# EAGLE design V2 (EAGLE 9.3.0)
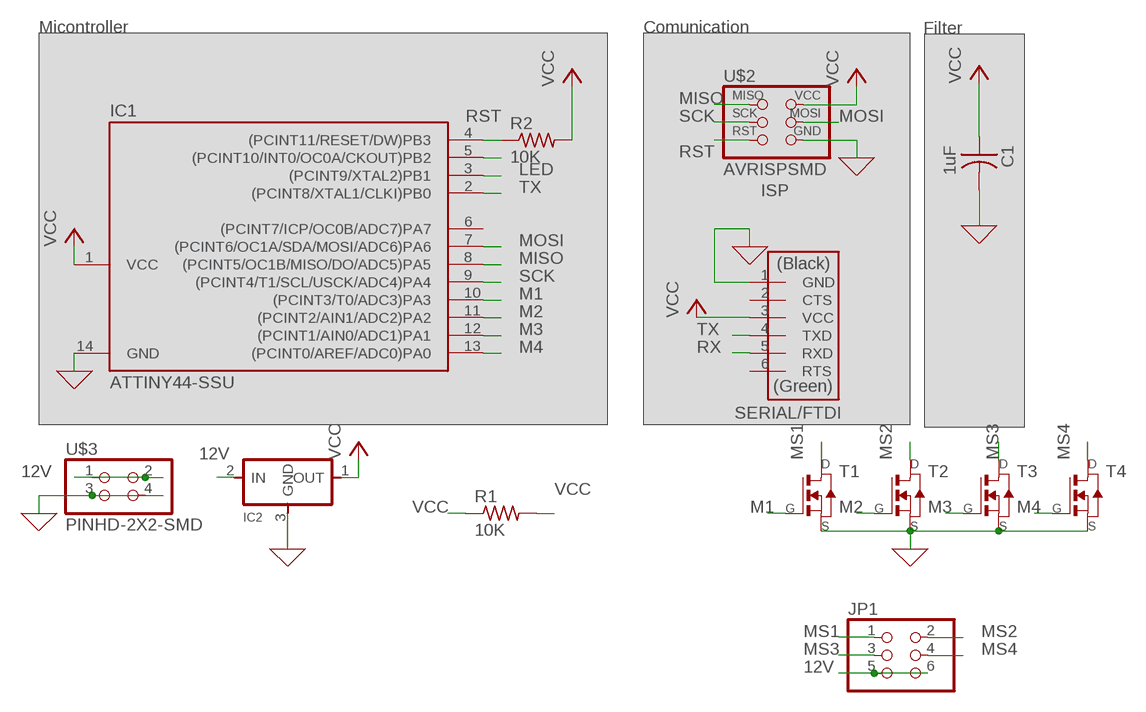
[diagram p0: schematic, sheet 1]

## Parts
C1  1uF  CAP-US1206FAB  [C1206FAB]
IC1  ATTINY44-SSU  [SOIC14]
IC2  REGULATORSOT23  [SOT23]
JP1  PINHD-2X3-SMD  [2X03SMD]
R1  10K  RES-US1206FAB  [R1206FAB]
R2  10K  RES-US1206FAB  [R1206FAB]
T1  NMOSFETSOT23  [SOT-23]
T2  NMOSFETSOT23  [SOT-23]
T3  NMOSFETSOT23  [SOT-23]
T4  NMOSFETSOT23  [SOT-23]
U$1  FTDI-SMD-HEADER  [1X06SMD]
U$2  AVRISPSMD  [2X03SMD]
U$3  PINHD-2X2-SMD  [2X02SMD]

## Nets
0: C1.2 IC1.14(GND) IC2.3(GND) T1.2(S) T2.2(S) T3.2(S) T4.2(S) U$1.1(GND) U$2.6(GND) U$3.3 U$3.4 ; supply symbol labelled GND
12V: IC2.2(IN) JP1.5 JP1.6 U$3.1 U$3.2
LED: IC1.3((PCINT9/XTAL2)PB1)
M1: IC1.10((PCINT3/T0/ADC3)PA3) T1.3(G)
M2: IC1.11((PCINT2/AIN1/ADC2)PA2) T2.3(G)
M3: IC1.12((PCINT1/AIN0/ADC1)PA1) T3.3(G)
M4: IC1.13((PCINT0/AREF/ADC0)PA0) T4.3(G)
MISO: IC1.8((PCINT5/OC1B/MISO/DO/ADC5)PA5) U$2.1(MISO)
MOSI: IC1.7((PCINT6/OC1A/SDA/MOSI/ADC6)PA6) U$2.4(MOSI)
MS1: JP1.1 T1.1(D)
MS2: JP1.2 T2.1(D)
MS3: JP1.3 T3.1(D)
MS4: JP1.4 T4.1(D)
N$5: IC1.5((PCINT10/INT0/OC0A/CKOUT)PB2)
RST: IC1.4((PCINT11/RESET/DW)PB3) R2.1 U$2.5(RST)
RX: U$1.5(RXD)
SCK: IC1.9((PCINT4/T1/SCL/USCK/ADC4)PA4) U$2.3(SCK)
TX: IC1.2((PCINT8/XTAL1/CLKI)PB0) U$1.4(TXD)
VCC: C1.1 IC1.1(VCC) IC2.1(OUT) R1.1 R1.2 R2.2 U$1.3(VCC) U$2.2(VCC)
Unconnected: IC1.6((PCINT7/ICP/OC0B/ADC7)PA7) U$1.2(CTS) U$1.6(RTS)

## Notes on the sheet
- Micontroller | Comunication | Filter
- ISP
- SERIAL/FTDI

## Library data of the parts
C1 = fab:CAP-US
IC1 = fab:ATTINY44
IC2 = fab:REGULATOR
JP1 = fab:PINHD-2X3-SMD: PIN HEADER
R1 R2 = fab:RES-US: Resistor (US Symbol) Variants with postfix FAB are widened to allow the routing of internal traces
T1-T4 = fab:NMOSFET: MOS FET
U$1 = fab:FTDI-SMD-HEADER
U$2 = fab:AVRISP
U$3 = fab:PINHD-2X2-SMD

## Board
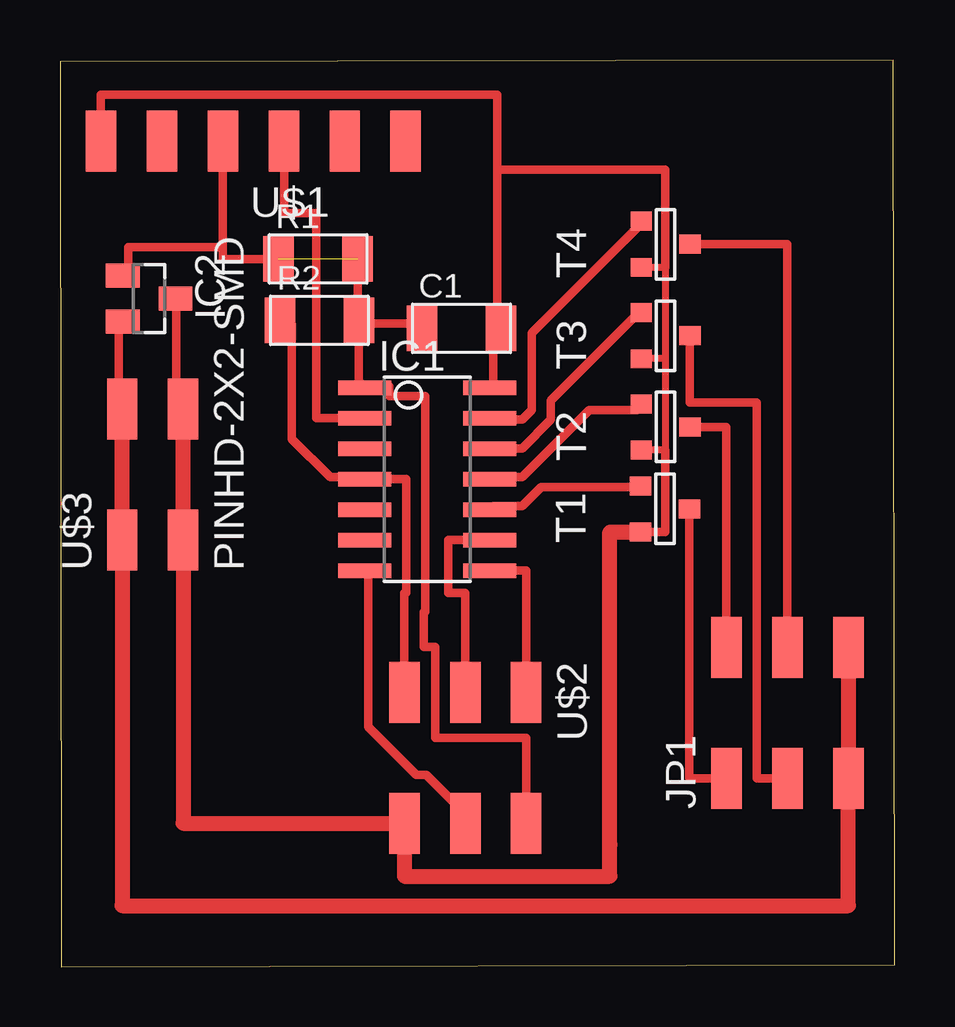
[diagram p1: board, top side]

Size 34.78 x 37.8 mm. Coordinates in mm from the lower left corner, seen from the top.
Outline: 0.05,0 34.78,0.08 34.73,37.8 0,37.72 0.05,0
Copper layers (1*16): Top 0.035mm / dielectric 1.5mm / Bottom 0.035mm
Design rules "default *": minimum track width 0.35mm, minimum drill 0.35mm, track to track 0.45mm, track to pad 0.45mm, pad to pad 0.45mm, via to via 0.45mm, smd to smd 0.45mm, copper to edge 40mil, drill to drill 6mil, minimum pad ring 10mil, minimum via ring 8mil, stop-mask expansion 4mil, vias tented up to drill 0mil, thermal gap 10mil

### Footprints (pad centres in the part's own frame; a part is rotated, then mirrored left to right if it is on the bottom)
C1206FAB = smd 1.27 x 1.905: 1 -1.651,0; 2 1.651,0
SOIC14 = smd 0.61 x 2.21: 1 -3.81,-2.603; 2 -2.54,-2.603; 3 -1.27,-2.603; 4 0,-2.603; 5 1.27,-2.603; 6 2.54,-2.603; 7 3.81,-2.603; 8 3.81,2.603; 9 2.54,2.603; 10 1.27,2.603; 11 0,2.603; 12 -1.27,2.603; 13 -2.54,2.603; 14 -3.81,2.603
SOT23 = smd 1 x 1.4: 1 -0.95,-1.1; 2 0.95,-1.1; 3 0,1.1
2X03SMD = smd 2.54 x 1.27: 1 -2.54,2.54; 2 2.92,2.54; 3 -2.54,0; 4 2.92,0; 5 -2.54,-2.54; 6 2.92,-2.54
R1206FAB = smd 1.27 x 1.905: 1 -1.651,0; 2 1.651,0
SOT-23 = smd 0.787 x 0.889: 1 0.025,-1.016; 2 -0.94,1.016; 3 0.991,1.016
1X06SMD = smd 2.54 x 1.27: 1 0,6.35; 2 0,3.81; 3 0,1.27; 4 0,-1.27; 5 0,-3.81; 6 0,-6.35
2X02SMD = smd 2.54 x 1.27: 1 -2.54,1.27; 2 2.92,1.27; 3 -2.54,-1.27; 4 2.92,-1.27

### Placement (x,y rotation side)
C1  16.73,26.61 0 top
IC1  15.29,20.32 270 top
IC2  3.71,27.85 270 top
JP1  30.31,10.38 90 top
R1  10.75,29.5 0 top
R2  10.81,26.94 0 top
T1  25.21,19.05 90 top
T2  25.23,22.47 90 top
T3  25.23,26.28 90 top
T4  25.23,30.09 90 top
U$1  8.05,34.42 90 top
U$2  16.89,8.9 270 top
U$3  3.86,20.32 90 top

### Tracks (layer width: path | path; a pad name or v marks a point on that pad's centre or on a via)
0
  Top 0.3: T1.2 24.01,18.29 | T4.2 25.21,29.15 25.21,25.34 | 25.21,25.34 T3.2 | 25.21,25.34 25.21,21.53 T2.2
  Top 0.35: 25.21,21.53 25.21,18.11 T1.2 | 18.21,26.5 18.05,26.4 18.05,24.4 IC1.14 | 18.21,26.5 C1.2 18.05,26.8 | 2.05,34.8 U$1.1 1.7,36.36 18.21,36.36 18.21,33.22 | IC2.3 4.85,27.6 4.85,23.6 U$3.4 | 18.21,33.22 18.21,26.5 | 25.21,29.15 25.21,33.22 18.21,33.22
  Top 0.635: U$2.6 5.13,5.98 U$3.3 U$3.4 | U$2.6 14.35,5.08 | T1.2 22.91,18.11 22.91,5.08 22.92,5.08 22.92,3.76 14.35,3.76 U$2.6
12V
  Top 0.35: IC2.2 2.45,26.8 2.45,24.4 U$3.2 2.45,23.2 2.59,23.2
  Top 0.635: 2.59,24.13 U$3.2 2.59,23.2 U$3.1 2.59,2.54 32.85,2.54 JP1.5 JP1.6
M1
  Top 0.35: T1.3 24.05,20 20.05,20 19.25,19.2 18.05,19.2 IC1.10
M2
  Top 0.35: T2.3 24.05,23.2 22.05,23.2 19.25,20.4 18.05,20.4 IC1.11
M3
  Top 0.35: T3.3 24.05,27.2 20.45,23.6 20.45,22.8 19.25,21.6 18.05,21.6 IC1.12
M4
  Top 0.35: T4.3 24.05,30.8 19.65,26.4 19.65,23.2 19.25,22.8 18.05,22.8 IC1.13
MISO
  Top 0.35: U$2.1 19.43,16.51 IC1.8
MOSI
  Top 0.35: IC1.7 12.85,16.4 12.85,10 14.85,8 15.25,8 17.25,6 U$2.4
MS1
  Top 0.35: T1.1 26.23,7.84 JP1.1
MS2
  Top 0.35: JP1.2 27.77,22.49 T2.1
MS3
  Top 0.35: T3.1 26.25,23.51 29.03,23.51 29.03,7.84 JP1.3
MS4
  Top 0.35: JP1.4 30.31,30.11 T4.1
RST
  Top 0.35: U$2.5 14.35,15.58 14.42,15.58 14.42,20.32 IC1.4 12.45,20.4 11.25,20.4 9.65,22 9.65,26.79 R2.1
SCK
  Top 0.35: U$2.3 16.89,15.58 16.17,15.58 16.17,17.78 IC1.9
TX
  Top 0.35: IC1.2 10.68,22.86 10.68,31.41 9.35,31.41 9.35,34.42 U$1.4
VCC  (1 unrouted)
  Top 0.35: U$2.2 19.43,9.54 15.63,9.54 15.63,13.33 15.15,13.33 15.15,14.78 15.22,14.78 15.22,23.79 13.72,23.79 13.72,24.21 12.69,24.21 IC1.1 12.45,24.4 R2.2 | 12.79,26.8 14.85,26.8 C1.1 | 12.79,26.8 R2.2 | 6.45,33.6 6.45,34.4 U$1.3 6.78,30 | IC2.1 2.85,28.8 2.85,30 6.78,30 | 12.34,27.22 R2.2 | R1.1 6.78,29.5 6.78,30 | R1.2 12.41,26.8 12.79,26.8